# EAGLE design P2345 (EAGLE 9.4.2)
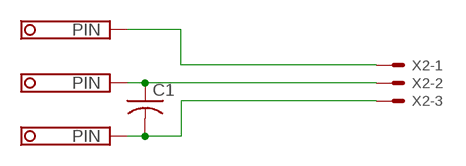
[diagram p0: schematic, sheet 1]

## Parts
C1  C-US050-024X044  [C050-024X044]
X1  TERMINAL-BLOCK-3.5MM-3-PIN-ROUND-PAD  [TERMINAL-BLOCK-3-PIN-3.5MM-ROUND-PAD]
X2  JST-XH-03-PIN-ROUND-PAD  [JST-XH-03-PACKAGE-ROUND-PAD]

## Nets
N$1: X1.1 X2.1
N$2: C1.1 X1.2 X2.2
N$3: C1.2 X1.3 X2.3

## Library data of the parts
C1 = adafruit:C-US: CAPACITOR, American symbol
X1 = Rembrandt Electronics - Terminal Block 3-5mm v1-0:TERMINAL-BLOCK-3.5MM-3-PIN: Terminal Block 3.5mm Pitch: 3,5 mm Number of pins: 3 Created by Rembrandt Electronics www.rembrandtelectronics.com
X2 = Rembrandt Electronics - Terminal Block 2.54 v1-0:JST-XH-03-PIN: JST XH Connector 2 Pin Wire to board connector. Pitch: 2,54 mm, (0.100") Number of pins: 3 Created by Rembrandt Electronics www.rembrandtelectronics.com

## Board
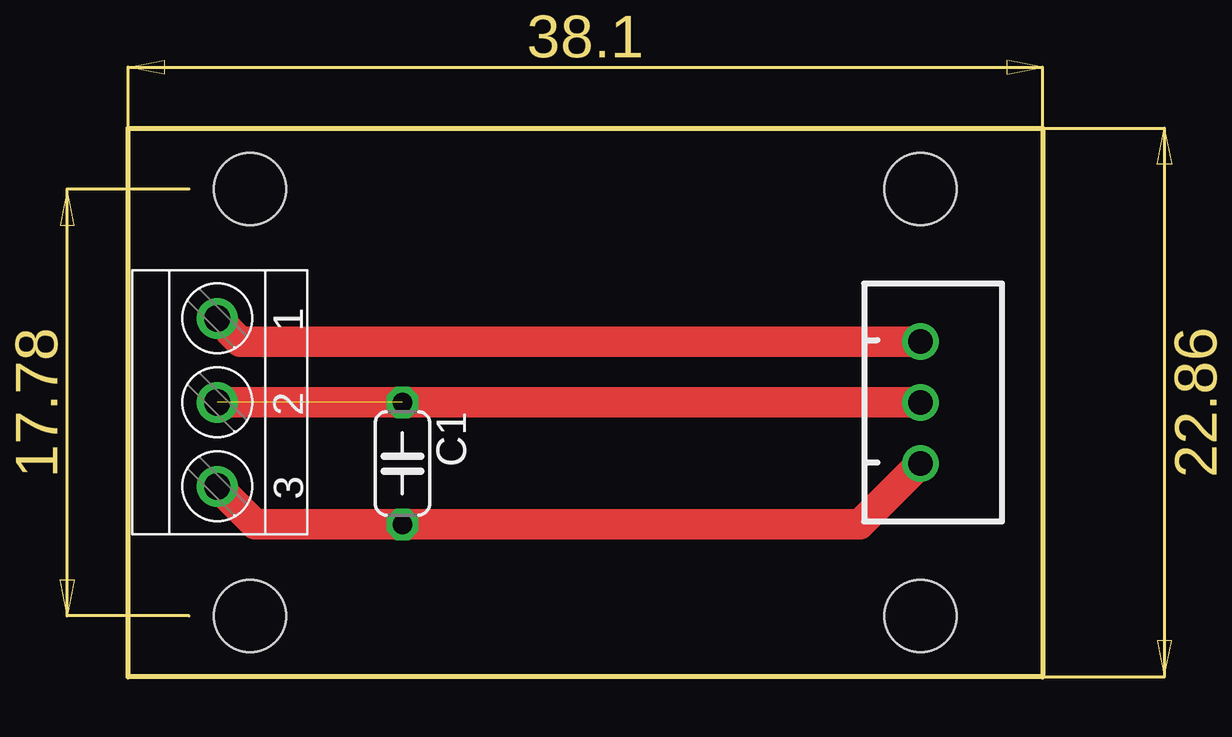
[diagram p1: board, top side]

Size 38.1 x 22.86 mm. Coordinates in mm from the lower left corner, seen from the top.
Outline: 0,22.86 38.1,22.86 38.1,0 0,0 0,22.86
Copper layers (1*16): Top 0.035mm / dielectric 1.5mm / Bottom 0.035mm
Design rules "default": minimum track width 6mil, minimum drill 0.35mm, track to track 6mil, track to pad 6mil, pad to pad 6mil, via to via 6mil, smd to smd 6mil, copper to edge 40mil, drill to drill 6mil, minimum pad ring 10mil, minimum via ring 8mil, stop-mask expansion 4mil, vias tented up to drill 0mil, thermal gap 10mil
Holes 3 mm at 5.08,20.32 5.08,2.54 33.02,2.54 33.02,20.32

### Footprints (pad centres in the part's own frame; a part is rotated, then mirrored left to right if it is on the bottom)
C050-024X044 = drill 0.813 octagon: 1 -2.54,0; 2 2.54,0
TERMINAL-BLOCK-3-PIN-3.5MM-ROUND-PAD = drill 1.1 pad 1.7: 1 -3.5,-0.1; 2 0,-0.1; 3 3.5,-0.1
JST-XH-03-PACKAGE-ROUND-PAD = drill 1.016: 1 -2.54,0; 2 0,0; 3 2.54,0

### Placement (x,y rotation side)
C1  11.43,8.89 270 top
X1  3.81,11.43 270 top
X2  33.02,11.43 270 top

### Tracks (layer width: path | path; a pad name or v marks a point on that pad's centre or on a via)
N$1
  Top 1.27: X2.1 4.67,13.97 X1.1
N$2  (1 unrouted)
  Top 1.27: X2.2 X1.2
N$3
  Top 1.27: X1.3 5.29,6.35 C1.2 30.48,6.35 X2.3